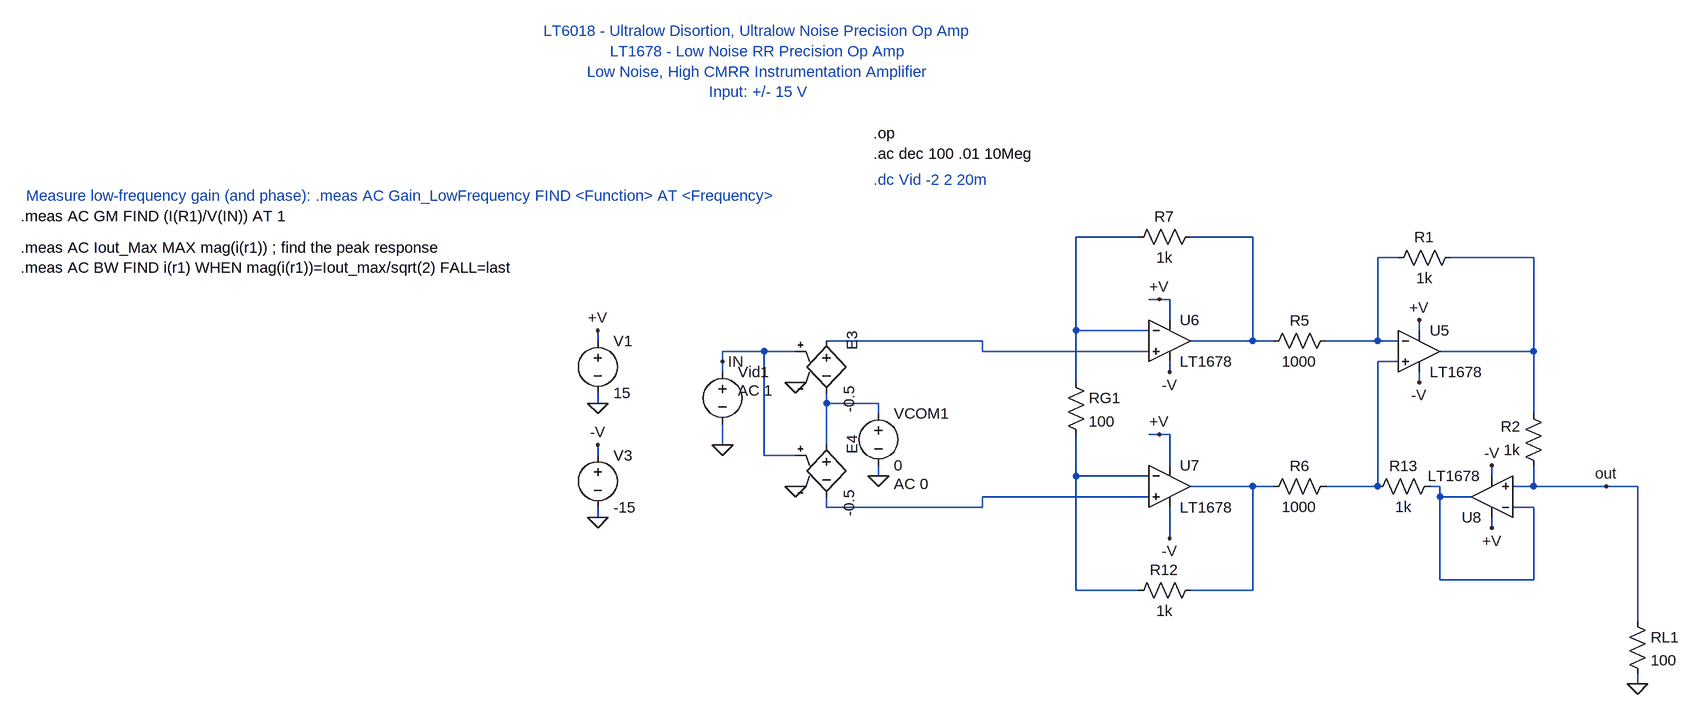
[diagram p0: schematic AI_VI_Buffer_Gm.asc]
AI_VI_Buffer_Gm.asc, the LTspice schematic file:
Version 4
SHEET 1 2004 1452
WIRE 240 176 144 176
WIRE 416 176 320 176
WIRE 640 208 608 208
WIRE 848 208 720 208
WIRE 272 272 256 272
WIRE 288 272 272 272
WIRE 288 304 288 272
WIRE 144 320 144 176
WIRE 256 320 144 320
WIRE 672 320 672 304
WIRE -592 336 -592 320
WIRE 0 336 -240 336
WIRE 416 336 416 176
WIRE 416 336 320 336
WIRE 448 336 416 336
WIRE 608 336 608 208
WIRE 608 336 528 336
WIRE 640 336 608 336
WIRE -336 352 -400 352
WIRE -288 352 -336 352
WIRE 0 352 0 336
WIRE 256 352 0 352
WIRE 848 352 848 208
WIRE 848 352 704 352
WIRE -400 368 -400 352
WIRE 640 368 608 368
WIRE -400 384 -400 368
WIRE 288 384 288 368
WIRE 144 400 144 320
WIRE 672 400 672 384
WIRE -592 432 -592 416
WIRE -240 432 -240 416
WIRE -160 432 -240 432
WIRE -160 448 -160 432
WIRE 848 448 848 352
WIRE 272 480 256 480
WIRE 288 480 272 480
WIRE -400 496 -400 464
WIRE -240 496 -240 432
WIRE -592 512 -592 496
WIRE -336 512 -336 352
WIRE -288 512 -336 512
WIRE 288 528 288 480
WIRE -160 544 -160 528
WIRE 144 544 144 480
WIRE 256 544 144 544
WIRE 784 544 784 528
WIRE 416 560 320 560
WIRE 448 560 416 560
WIRE 608 560 608 368
WIRE 608 560 528 560
WIRE 704 560 688 560
WIRE 848 560 848 528
WIRE 848 560 816 560
WIRE 960 560 848 560
WIRE 1008 560 960 560
WIRE 256 576 0 576
WIRE 704 576 704 560
WIRE 752 576 704 576
WIRE -240 592 -240 576
WIRE 0 592 0 576
WIRE 0 592 -240 592
WIRE 848 592 816 592
WIRE -592 608 -592 592
WIRE 784 624 784 608
WIRE 288 640 288 592
WIRE 704 704 704 576
WIRE 848 704 848 592
WIRE 848 704 704 704
WIRE 144 720 144 544
WIRE 240 720 144 720
WIRE 416 720 416 560
WIRE 416 720 320 720
WIRE 1008 768 1008 560
WIRE 1008 864 1008 848
FLAG -592 432 0
FLAG -592 608 0
FLAG -592 320 +V
FLAG -592 496 -V
FLAG 272 272 +V
FLAG 288 640 -V
FLAG 672 304 +V
FLAG 672 400 -V
FLAG 272 480 +V
FLAG 288 384 -V
FLAG 784 624 +V
FLAG 784 528 -V
FLAG 1008 864 0
FLAG 960 560 out
FLAG -160 544 0
FLAG -400 368 IN
FLAG -400 496 0
FLAG -288 400 0
FLAG -288 560 0
DATAFLAG 144 320 ""
SYMBOL voltage -592 320 R0
WINDOW 123 0 0 Left 2
WINDOW 39 0 0 Left 2
SYMATTR InstName V1
SYMATTR Value 15
SYMBOL voltage -592 496 R0
WINDOW 123 0 0 Left 2
WINDOW 39 0 0 Left 2
SYMATTR InstName V3
SYMATTR Value -15
SYMBOL Opamps\\LT1678 672 352 R0
SYMATTR InstName U5
SYMBOL res 736 192 R90
WINDOW 0 0 56 VBottom 2
WINDOW 3 32 56 VTop 2
SYMATTR InstName R1
SYMATTR Value 1k
SYMATTR SpiceLine tol=1 pwr=0.1
SYMBOL res 864 544 R180
WINDOW 0 36 76 Left 2
WINDOW 3 36 40 Left 2
SYMATTR InstName R2
SYMATTR Value 1k
SYMATTR SpiceLine tol=1 pwr=0.1
SYMBOL res 544 320 R90
WINDOW 0 0 56 VBottom 2
WINDOW 3 32 56 VTop 2
SYMATTR InstName R5
SYMATTR Value 1000
SYMATTR SpiceLine tol=1 pwr=0.1
SYMBOL res 544 544 R90
WINDOW 0 0 56 VBottom 2
WINDOW 3 32 56 VTop 2
SYMATTR InstName R6
SYMATTR Value 1000
SYMATTR SpiceLine tol=1 pwr=0.1
SYMBOL res 128 384 R0
SYMATTR InstName RG1
SYMATTR Value 100
SYMATTR SpiceLine tol=1 pwr=0.1
SYMBOL res 336 160 R90
WINDOW 0 0 56 VBottom 2
WINDOW 3 32 56 VTop 2
SYMATTR InstName R7
SYMATTR Value 1k
SYMATTR SpiceLine tol=1 pwr=0.1
SYMBOL res 336 704 R90
WINDOW 0 0 56 VBottom 2
WINDOW 3 32 56 VTop 2
SYMATTR InstName R12
SYMATTR Value 1k
SYMATTR SpiceLine tol=1 pwr=0.1
SYMBOL Opamps\\LT1678 288 336 R0
SYMATTR InstName U6
SYMBOL Opamps\\LT1678 288 560 R0
SYMATTR InstName U7
SYMBOL Opamps\\LT1678 784 576 R180
SYMATTR InstName U8
SYMBOL res 704 544 R90
WINDOW 0 0 56 VBottom 2
WINDOW 3 32 56 VTop 2
SYMATTR InstName R13
SYMATTR Value 1k
SYMATTR SpiceLine tol=1 pwr=0.1
SYMBOL res 992 752 R0
SYMATTR InstName RL1
SYMATTR Value 100
SYMBOL voltage -400 368 R0
WINDOW 123 24 44 Left 2
WINDOW 39 24 117 Left 2
WINDOW 3 24 72 Left 2
SYMATTR Value2 AC 1
SYMATTR Value ""
SYMATTR InstName Vid1
SYMBOL voltage -160 432 R0
WINDOW 123 24 124 Left 2
WINDOW 39 24 117 Left 2
SYMATTR Value2 AC 0
SYMATTR InstName VCOM1
SYMATTR Value 0
SYMBOL e -240 320 R0
WINDOW 0 39 1 VRight 2
WINDOW 3 35 85 VRight 2
SYMATTR InstName E3
SYMATTR Value -0.5
SYMBOL e -240 480 R0
WINDOW 0 39 1 VRight 2
WINDOW 3 35 85 VRight 2
SYMATTR InstName E4
SYMATTR Value -0.5
TEXT -344 -32 Bottom 2 ;LT6018 - Ultralow Disortion, Ultralow Noise Precision Op Amp\nLT1678 - Low Noise RR Precision Op Amp\nLow Noise, High CMRR Instrumentation Amplifier\nInput: +/- 15 V
TEXT -168 48 Left 2 !.ac dec 100 .01 10Meg
TEXT -1480 144 Left 2 !.meas AC GM FIND (I(R1)/V(IN)) AT 1
TEXT -1472 112 Left 2 ;Measure low-frequency gain (and phase): .meas AC Gain_LowFrequency FIND <Function> AT <Frequency>
TEXT -1480 192 Left 2 !.meas AC Iout_Max MAX mag(i(r1)) ; find the peak response\n.meas AC BW FIND i(r1) WHEN mag(i(r1))=Iout_max/sqrt(2) FALL=last
TEXT -168 16 Left 2 !.op
TEXT -168 88 Left 2 ;.dc Vid -2 2 20m

The netlist it stands for:
* AI_VI_Buffer_Gm.asc
V1 +V 0 15
V3 -V 0 -15
XU5 N006 N003 N004 +V -V LT1678  ; pins In+ In- OUT V+ V-
R1 N004 N003 1k tol=1 pwr=0.1
R2 out N004 1k tol=1 pwr=0.1
R5 N003 N002 1000 tol=1 pwr=0.1
R6 N006 N009 1000 tol=1 pwr=0.1
RG1 N001 N008 100 tol=1 pwr=0.1
R7 N002 N001 1k tol=1 pwr=0.1
R12 N009 N008 1k tol=1 pwr=0.1
XU6 N005 N001 N002 +V -V LT1678  ; pins In+ In- OUT V+ V-
XU7 N011 N008 N009 +V -V LT1678  ; pins In+ In- OUT V+ V-
XU8 out N010 N010 +V -V LT1678  ; pins In+ In- OUT V+ V-
R13 N010 N006 1k tol=1 pwr=0.1
RL1 out 0 100
Vid1 IN 0 AC 1
VCOM1 N007 0 0 AC 0
E3 N005 N007 IN 0 -0.5
E4 N007 N011 IN 0 -0.5
* LT6018 - Ultralow Disortion, Ultralow Noise Precision Op Amp
* LT1678 - Low Noise RR Precision Op Amp
* Low Noise, High CMRR Instrumentation Amplifier
* Input: +/- 15 V
.ac dec 100 .01 10Meg
.meas AC GM FIND (I(R1)/V(IN)) AT 1
* Measure low-frequency gain (and phase): .meas AC Gain_LowFrequency FIND <Function> AT <Frequency>
.meas AC Iout_Max MAX mag(i(r1)) ; find the peak response
.meas AC BW FIND i(r1) WHEN mag(i(r1))=Iout_max/sqrt(2) FALL=last
.op
* .dc Vid -2 2 20m
.backanno
.end